# EAGLE design RV Battery Monitor (EAGLE 9.5.0)
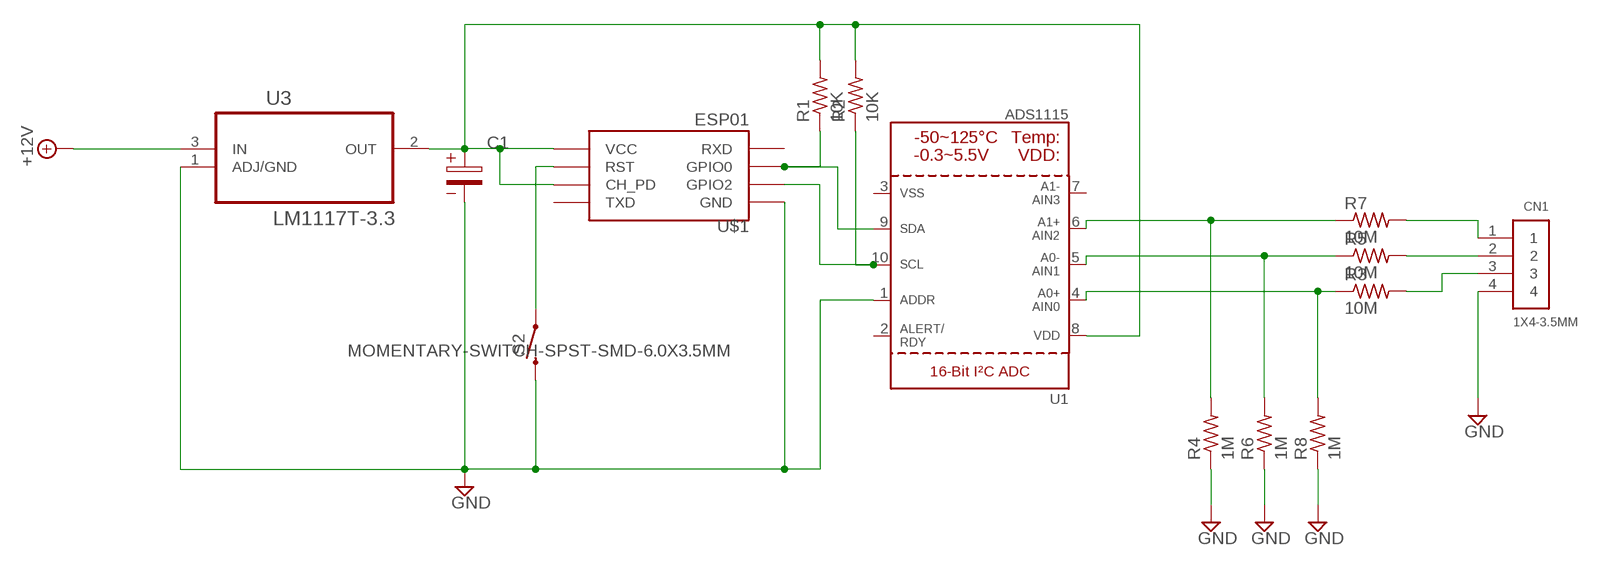
[diagram p0: schematic, sheet 1]

## Parts
C1  WCAP-AT1H_10X16_860241375002  [10X5X0.9(DXAXB)]
CN1  1X4-3.5MM  [1X04-3.5MM]
R1  10K  R-US_0207/7  [0207/7]
R2  10K  R-US_0207/7  [0207/7]
R3  10M  R-US_0207/7  [0207/7]
R4  1M  R-US_0207/7  [0207/7]
R5  10M  R-US_0207/7  [0207/7]
R6  1M  R-US_0207/7  [0207/7]
R7  10M  R-US_0207/7  [0207/7]
R8  1M  R-US_0207/7  [0207/7]
S2  MOMENTARY-SWITCH-SPST-SMD-6.0X3.5MM  [TACTILE_SWITCH_SMD_6.0X3.5MM]
U1  ADS1115  [MSOP10]
U3  LM1117T-3.3  [TO254P470X1016X2222-3P]
U$1  ESP01  [ESP01]

## Nets
+12V: U3.3(IN)
GND: C1.2 CN1.4 R4.1 R6.1 R8.1 S2.2 U1.1(ADDR) U3.1(ADJ/GND) U$1.GND
N$1: R2.1 U1.10(SCL) U$1.GPIO2
N$2: R1.1 U1.9(SDA) U$1.GPIO0
N$4: R3.1 R8.2 U1.4(AIN0)
N$5: R5.1 R6.2 U1.5(AIN1)
N$6: R4.2 R7.1 U1.6(AIN2)
N$7: CN1.1 R7.2
N$8: CN1.2 R5.2
N$9: CN1.3 R3.2
N$10: S2.1 U$1.RST
N$12: C1.1 R1.2 R2.2 U1.8(VDD) U3.2(OUT) U$1.CH_PD U$1.VCC
Unconnected: U1.2(ALERT/RDY) U1.3(VSS) U1.7(AIN3) U$1.RX(RXD) U$1.TX(TXD)

## Library data of the parts
C1 = Wurth_Elektronik_Passive_Capacitors_rev18b:WCAP-AT1H: WCAP-AT1H Aluminum Electrolytic Capacitors Characteristics Aluminum Electrolytic Capacitor Recommended soldering: Wave Operating temperature: -40 °C to +105 °C for UR ˂ 400 V; -25 °C to +105 °C for UR ≥ 400V Long life product series Higher permissible ripple current Load life: 5000-10000 h @ + 105 °C Package name and Variant abbreviation: Package: D X A X B = Diameter of the outline X Pitch of the hole X Diameter of the hole. <http://katalog.we-online.de/media/images/eisos/WCAP-ATIH_pf2.jpg> Details see: http://katalog.we-online.de/en/pbs/WCAP-AT1H/ Updated by: Yingchun,Shan Updated: 2017-03-16 2017 (C) Wurth Elektronik; WE-NUMBER: 860241375002/10uF
CN1 = adafruit:1X4: 4-pin connector
R1-R8 = BeagleBone_Black_Wireless:R-US_: RESISTOR, American symbol
S2 = SparkFun-Switches:MOMENTARY-SWITCH-SPST: Momentary Switch (Pushbutton) - SPST Normally-open (NO) SPST momentary switches (buttons, pushbuttons). Variants PTH-12MM - 12mm square, through-hole Momentary Pushbutton Switch - 12mm Square <https://www.sparkfun.com/products/9190> (COM-09190) PTH-6.0MM, PTH-6.0MM-KIT - 6.0mm square, through-hole Mini Pushbutton Switch <https://www.sparkfun.com/products/97> (COM-00097) KIT package intended for soldering kit's - only one side of pads' copper is exposed. PTH-RIGHT-ANGLE-KIT - Right-angle, through-hole Right Angle Tactile Button <https://www.sparkfun.com/products/10791> - Used on SparkFun BigTime Watch Kit <https://www.sparkfun.com/products/11734> SMD-12MM - 12mm square, surface-mount Tactile Button - SMD (12mm) <https://www.sparkfun.com/products/12993> (COM-12993) Used on SparkFun PicoBoard <https://www.sparkfun.com/products/11888> SMD-4.5MM - 4.5mm Square Trackball Switch Used on SparkFun Blackberry Trackballer Breakout <https://www.sparkfun.com/products/13169> SMD-4.6MMX2.8MM - 4.60mm x 2.80mm, surface mount Used on SparkFun SAMD21 Mini Breakout <https://www.sparkfun.com/products/13664> SMD-5.2MM, SMD-5.2-REDUNDANT - 5.2mm square, surface-mount Mini Pushbutton Switch - SMD <https://www.sparkfun.com/products/8720> (COM-08720) Used on Arduino Pro Mini <https://www.sparkfun.com/products/11114> REDUNDANT package connects both switch circuits together SMD-6.0X3.5MM - 6.0 x 3.5mm, surface mount Momentary Reset Switch SMD <https://www.sparkfun.com/products/8229> (COM-08229) SMD-6.2MM-TALL - 6.2mm square, surface mount Tactile Button - SMD (6mm) <https://www.sparkfun.com/products/12992> Used on SparkFun Digital Sandbox <https://www.sparkfun.com/products/12651> SMD-RIGHT-ANGLE - Right-angle, surface mount Used on SparkFun Block for Intel® Edison - Arduino <https://www.sparkfun.com/products/13036>; PROD_ID: SWCH-00815; SF_SKU: COM-08229
U1 = ADS1115:ADS1115: 16-Bit Del-Sig ADC Four single-ended inputs or two differential inputs Internal PGA I2C interface 2.0-5.5V; AVAILABILITY: Unavailable; DESCRIPTION: 16-Bit ADC with Integrated MUX PGA Comparator Oscillator and Reference; MF: Texas Instruments; MP: ADS1115; PACKAGE: XFQFN-10 Texas Instruments; PRICE: None
U3 = LM1117T-3.3:LM1117T-3.3: IC, LDO VOLT REG, 3.3V, 0.8A; AVAILABILITY: Unavailable; DESCRIPTION: IC, LDO VOLT REG, 3.3V, 0.8A, TO-220; Primary Input Voltage: 20V; Output Voltage; MF: Texas Instruments; MP: LM1117T-3.3; PACKAGE: TO-220 Texas Instruments; PRICE: None
U$1 = esp8266modules:ESP01: ESP8266 Wifi module 01

## Module RESISTOR
Ports: 

### Library data of the parts

## Board
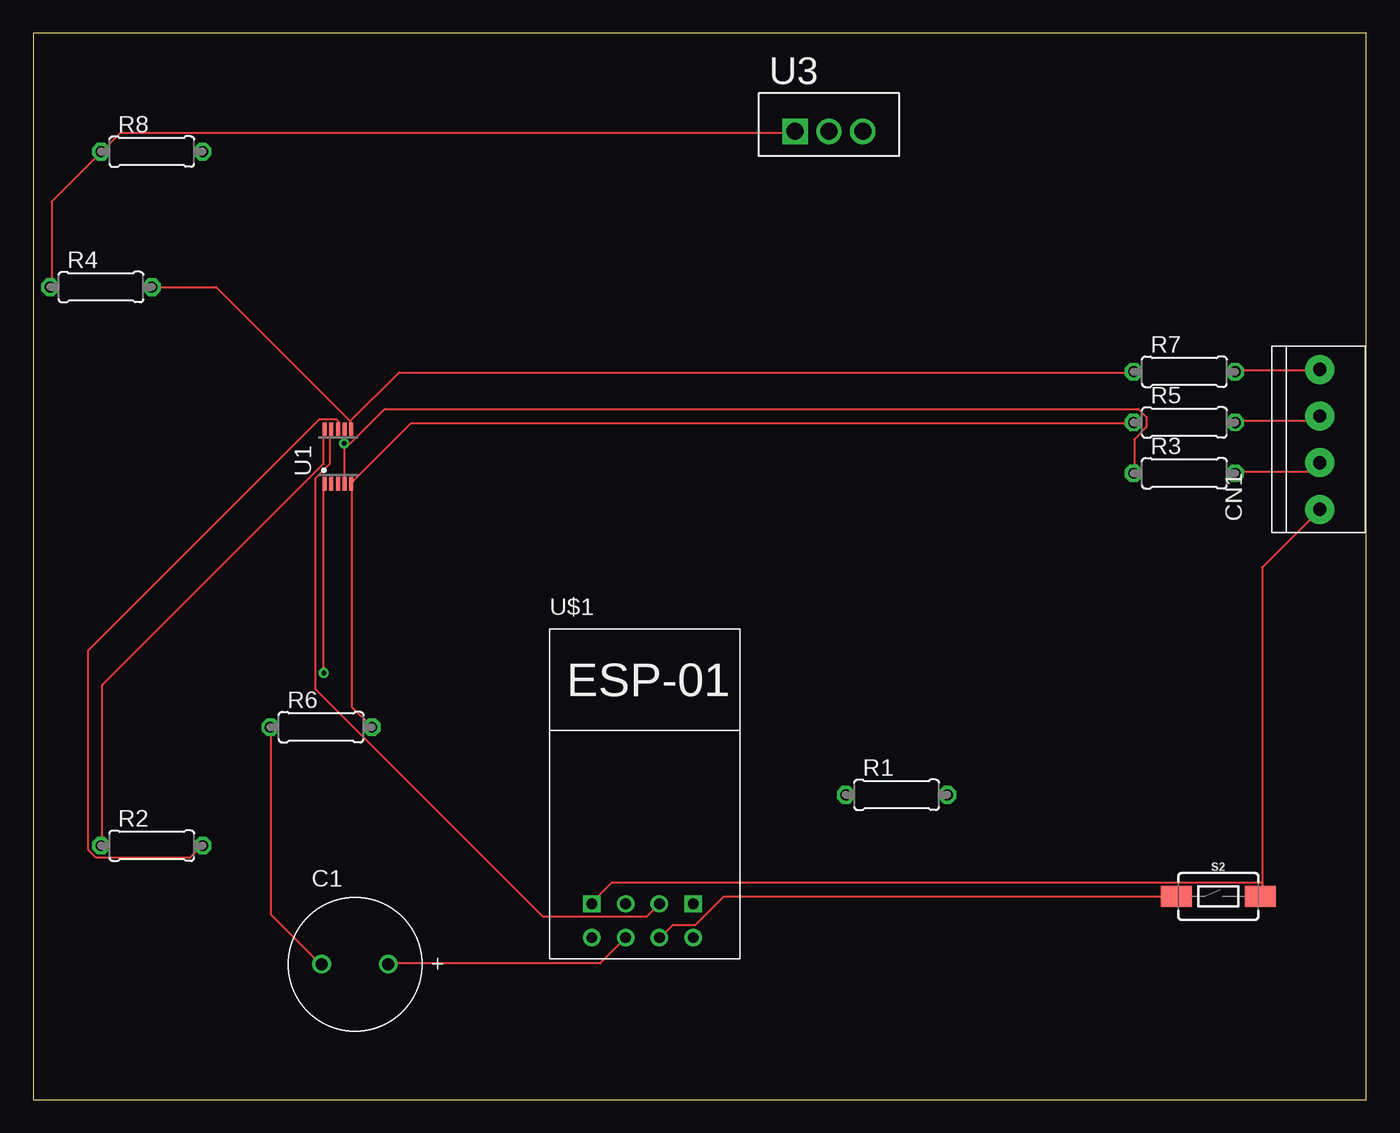
[diagram p1: board, top side]
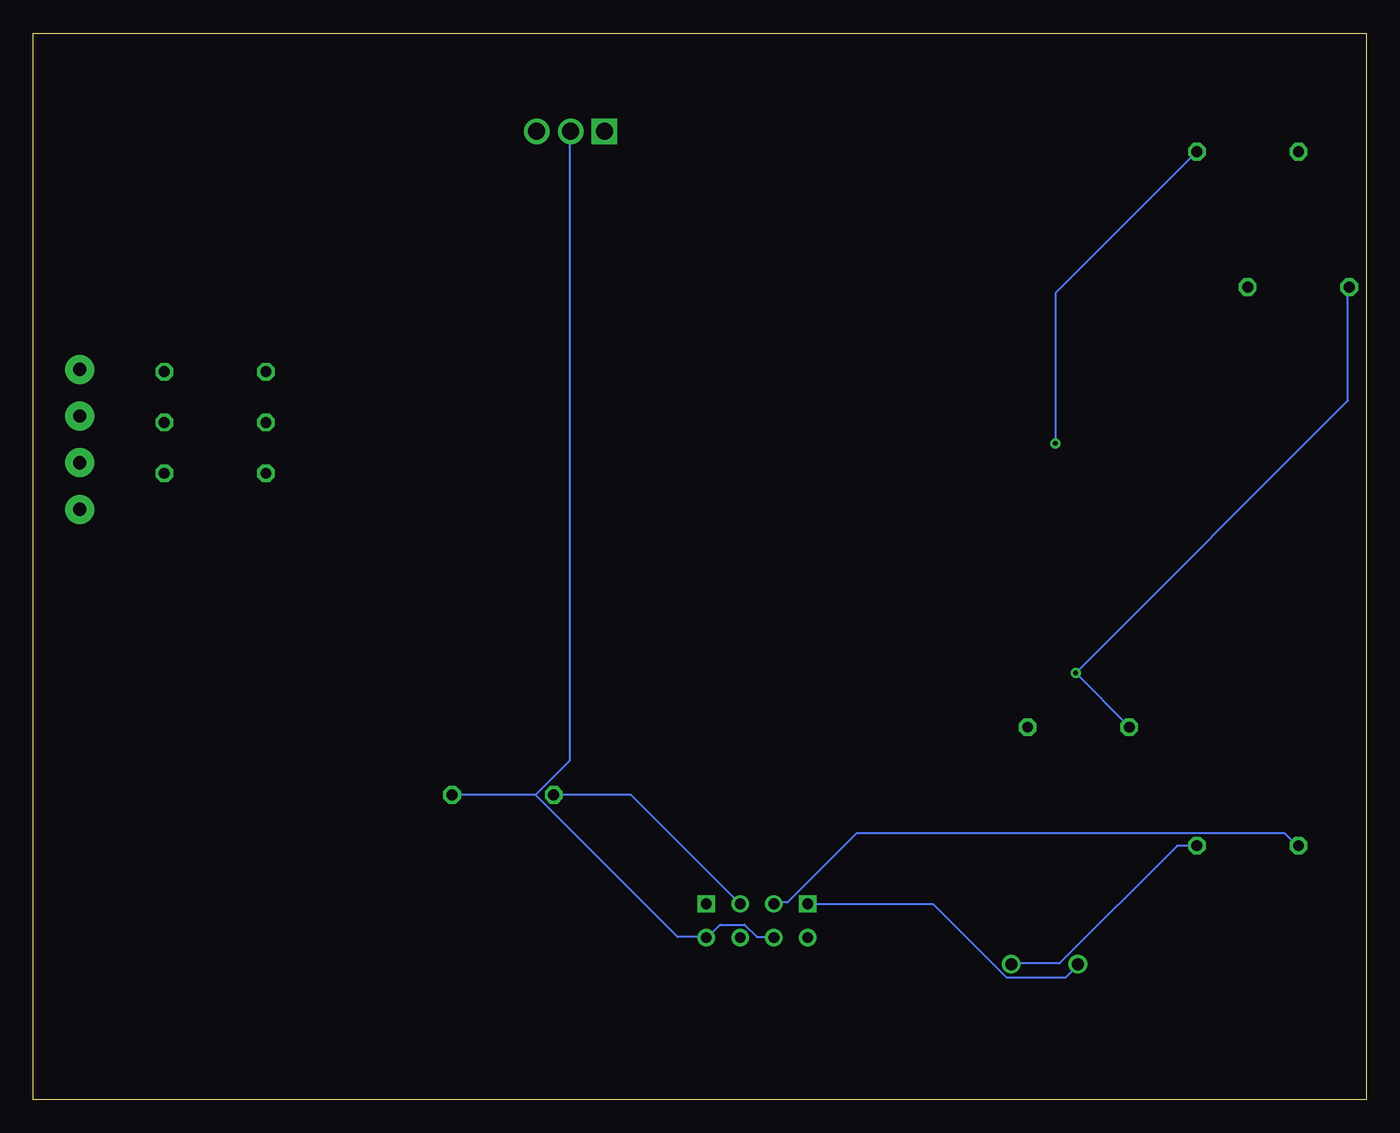
[diagram p2: board, bottom side, seen from below]

Size 100 x 80 mm. Coordinates in mm from the lower left corner, seen from the top.
Outline: 0,0 100,0 100,80 0,80 0,0
Copper layers (1*16): Top 0.035mm / dielectric 1.5mm / Bottom 0.035mm
Design rules "default": minimum track width 6mil, minimum drill 0.35mm, track to track 6mil, track to pad 6mil, pad to pad 6mil, via to via 6mil, smd to smd 6mil, copper to edge 40mil, drill to drill 6mil, minimum pad ring 10mil, minimum via ring 8mil, stop-mask expansion 4mil, vias tented up to drill 0mil, thermal gap 10mil

### Footprints (pad centres in the part's own frame; a part is rotated, then mirrored left to right if it is on the bottom)
10X5X0.9(DXAXB) = drill 0.9: 1 2.5,0; 2 -2.5,0
1X04-3.5MM = drill 1 pad 2.184: 1 -5.25,0; 2 -1.75,0; 3 1.75,0; 4 5.25,0
0207/7 = drill 0.813 octagon: 1 -3.81,0; 2 3.81,0
TACTILE_SWITCH_SMD_6.0X3.5MM = smd 2.3 x 1.6: 1 -3.15,0; 2 3.15,0
MSOP10 = smd 0.3 x 1: 1 -1,-2.05; 2 -0.5,-2.05; 3 0,-2.05; 4 0.5,-2.05; 5 1,-2.05; 6 1,2.05; 7 0.5,2.05; 8 0,2.05; 9 -0.5,2.05; 10 -1,2.05
TO254P470X1016X2222-3P = drill 1.27 square: 1 -5.08,-1.016 | drill 1.27: 2 -2.54,-1.016; 3 0,-1.016
ESP01 = drill 0.8: CH_PD -1.285,-8.178; GPIO0 1.255,-5.638; GPIO2 -1.285,-5.638; RST 1.255,-8.178; TX -3.825,-8.178; VCC 3.795,-8.178 | drill 0.8 square: GND -3.825,-5.638; RX 3.795,-5.638

### Placement (x,y rotation side)
C1  24.13,10.16 0 top
CN1  96.52,49.53 270 top
R1  64.77,22.86 0 top
R2  8.89,19.05 0 top
R3  86.36,46.99 0 top
R4  5.08,60.96 0 top
R5  86.36,50.8 0 top
R6  21.59,27.94 0 top
R7  86.36,54.61 0 top
R8  8.89,71.12 0 top
S2  88.9,15.24 0 top
U1  22.86,48.26 0 top
U3  62.23,73.66 0 top
U$1  45.72,20.32 0 top

### Tracks (layer width: path | path; a pad name or v marks a point on that pad's centre or on a via)
GND  (via drill 0.35)
  Top 0.152: R4.1 1.37,60.96 1.37,67.36 5.03,71.02 R8.1 5.18,71.17 6.55,72.54 57.15,72.54 U3.1 | 92.2,16.31 92.2,39.93 96.47,44.2 CN1.4 | 92.2,16.31 92.2,15.24 S2.2 | v21.79,32 21.79,46.18 U1.1 | R6.1 17.83,27.89 17.83,13.87 21.49,10.21 C1.2 | 92.2,16.31 43.43,16.31 41.91,14.78 U$1.GND
  Bottom 0.152: R6.1 17.83,28.04 v21.79,32 1.37,52.43 1.37,60.96 R4.1 | U$1.GND 41.76,14.63 32.46,14.63 26.98,9.14 22.55,9.14 21.64,10.06 C1.2
N$1
  Top 0.152: U1.10 21.79,50.29 21.79,47.7 5.18,31.09 5.18,19.05 R2.1
  Bottom 0.152: U$1.GPIO2 44.35,14.78 43.43,14.78 38.25,19.96 6.1,19.96 5.18,19.05 R2.1
N$2
  Top 0.152: U1.9 22.25,50.29 22.25,47.7 21.18,46.63 21.18,30.79 38.25,13.72 46.02,13.72 46.94,14.63 U$1.GPIO0
  Bottom 0.152: R1.1 55.17,22.86 47.09,14.78 U$1.GPIO0
N$4  (via drill 0.35)
  Top 0.152: U1.4 23.32,46.33 v23.32,49.23 23.77,49.23 26.36,51.82 82.91,51.82 83.52,51.21 83.52,50.44 82.6,49.53 82.6,47.09 R3.1
  Bottom 0.152: v23.32,49.23 23.32,60.5 R8.2
N$5
  Top 0.152: R6.2 23.93,29.41 23.93,46.18 U1.5 23.93,46.33 28.35,50.75 82.45,50.75 R5.1
N$6
  Top 0.152: 23.77,50.9 23.77,50.44 U1.6 | 23.77,50.9 13.72,60.96 R4.2 | 23.77,50.9 27.43,54.56 82.45,54.56 R7.1
N$7
  Top 0.152: R7.2 90.22,54.71 96.47,54.71 CN1.1
N$8
  Top 0.152: R5.2 90.22,50.9 96.16,50.9 96.47,51.21 CN1.2
N$9
  Top 0.152: R3.2 90.22,47.09 95.86,47.09 96.47,47.7 CN1.3
N$10
  Top 0.152: S2.1 51.82,15.24 49.68,13.11 48.01,13.11 47.09,12.19 U$1.RST
N$12
  Top 0.152: U1.8 22.86,50.9 22.71,51.05 21.49,51.05 4.12,33.68 4.12,18.75 4.72,18.14 11.73,18.14 12.65,19.05 R2.2 | C1.1 26.67,10.21 42.52,10.21 44.35,12.04 U$1.CH_PD
  Bottom 0.152: R2.2 14.17,19.05 23.01,10.21 26.52,10.21 C1.1 | U$1.CH_PD 44.5,12.19 45.72,12.19 46.63,13.11 48.46,13.11 49.38,12.19 U$1.VCC 49.53,12.19 51.66,12.19 62.33,22.86 | 62.33,22.86 R1.2 | 62.33,22.86 59.74,25.45 59.74,72.54 U3.2